# EAGLE design tactile_sensor (EAGLE 9.6.2)
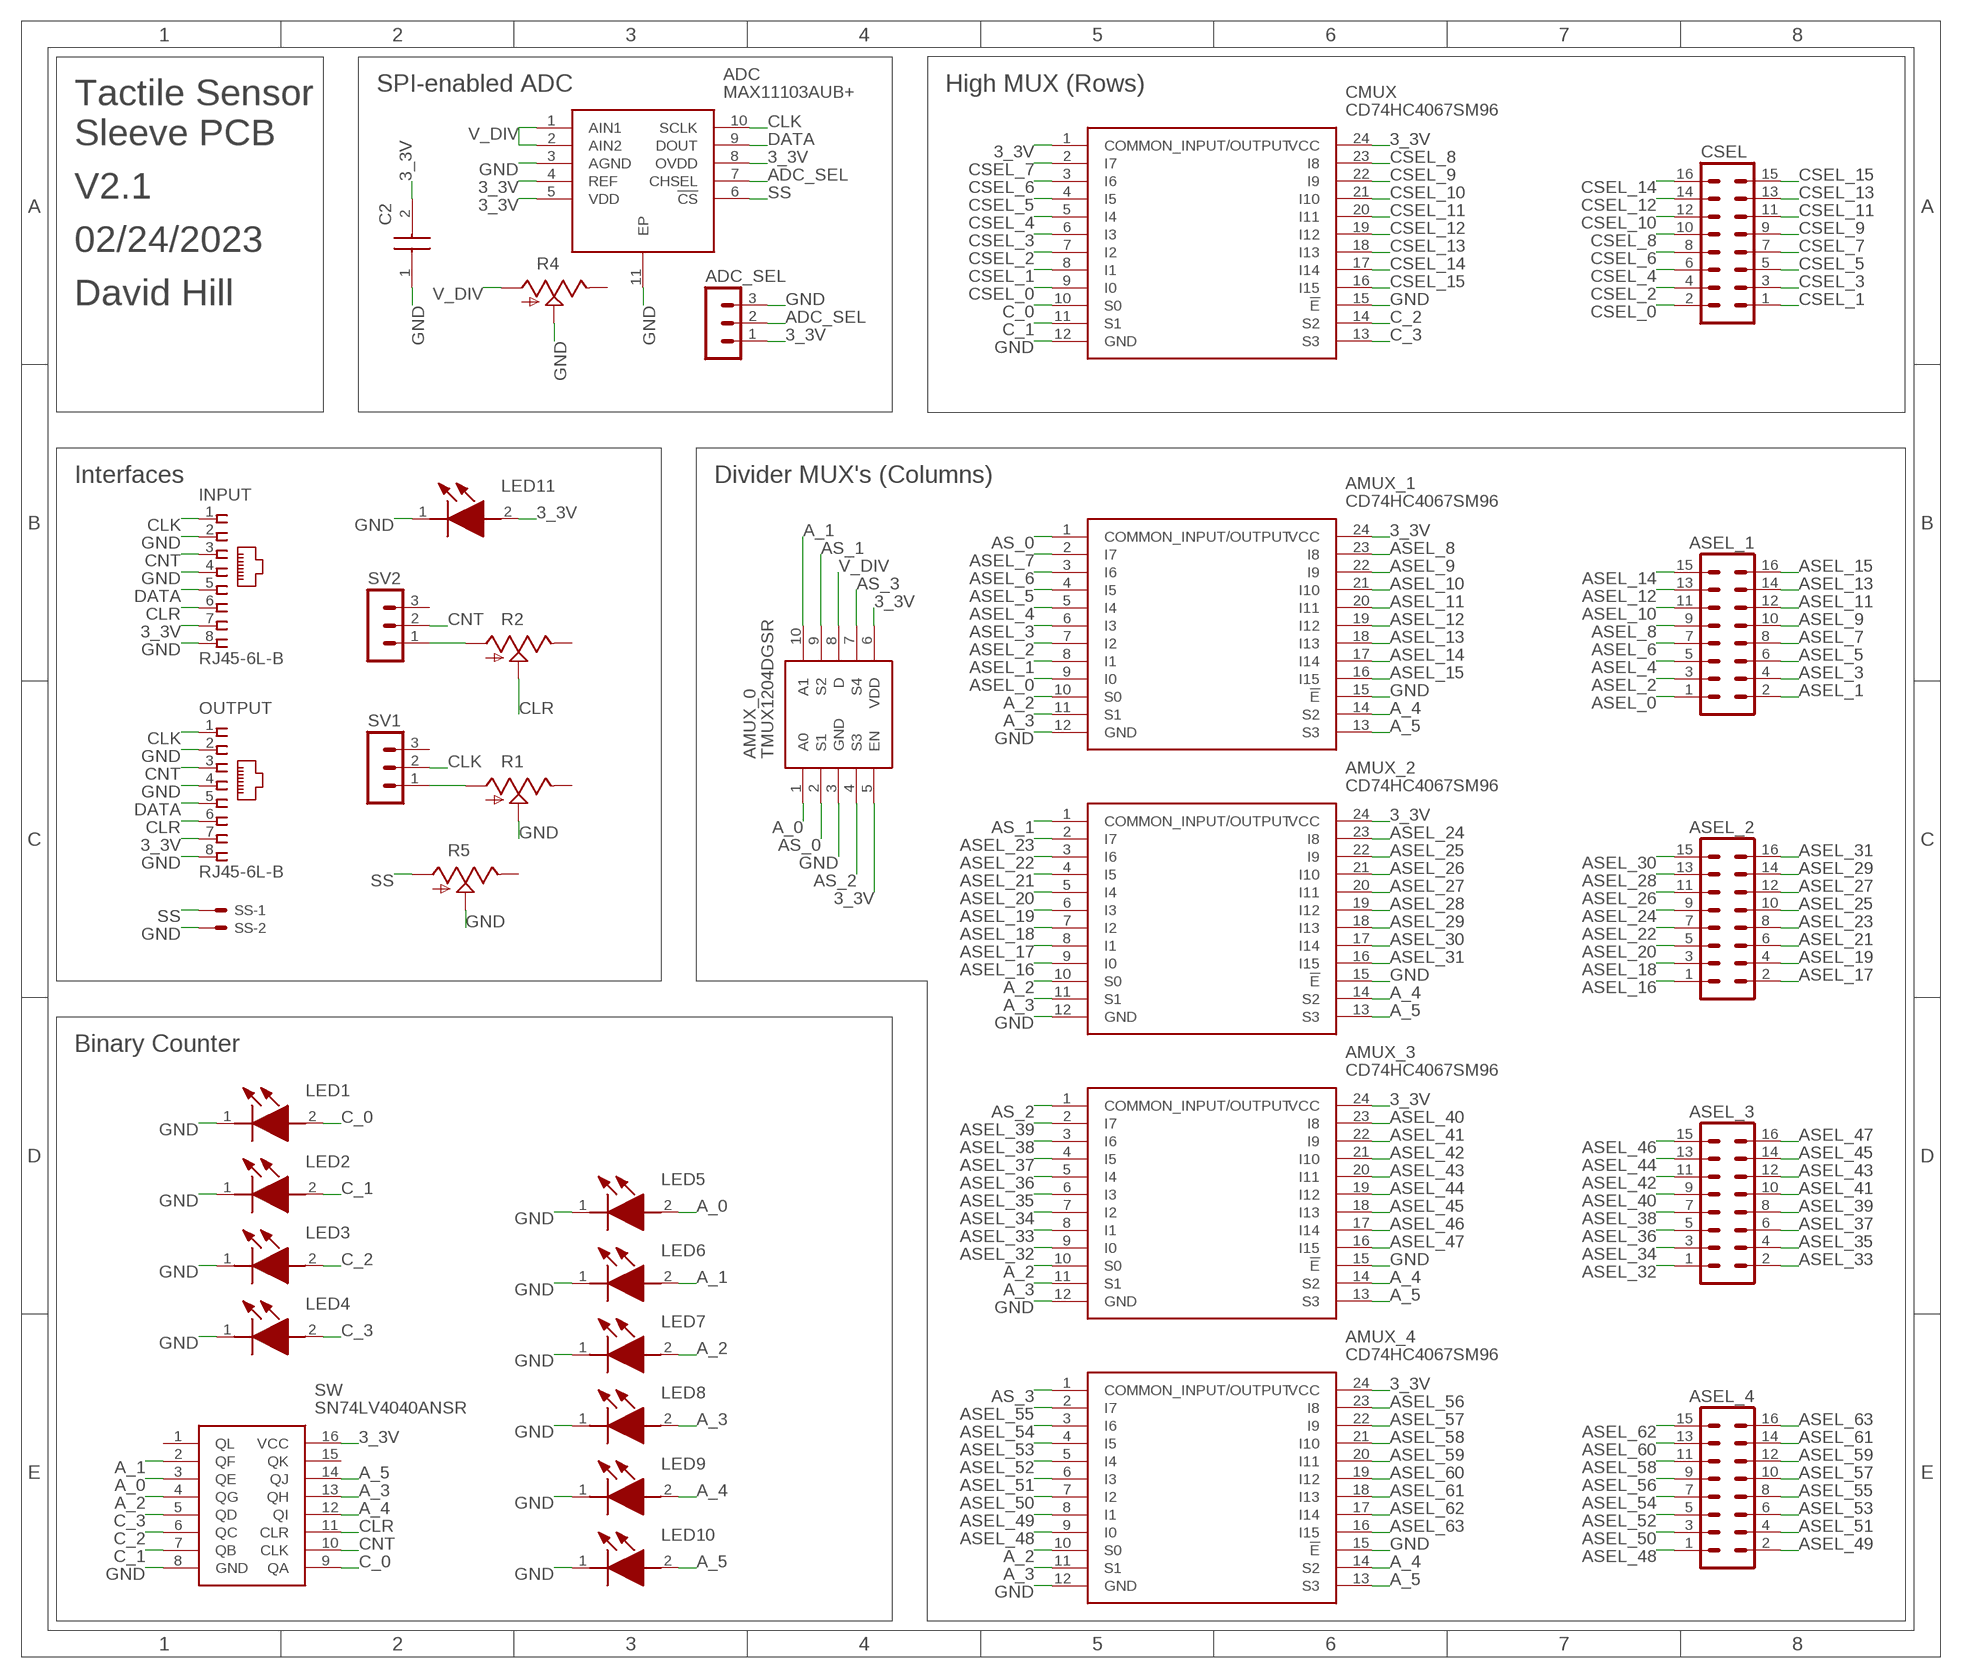
[diagram p0: schematic, sheet 1]

## Parts
ADC  MAX11103AUB+  [SOP50P490X110-11N]
ADC_SEL  MA03-1  [MA03-1]
AMUX_0  TMUX1204DGSR  [SOP50P490X110-10N]
AMUX_1  CD74HC4067SM96  [SOP65P780X200-24N]
AMUX_2  CD74HC4067SM96  [SOP65P780X200-24N]
AMUX_3  CD74HC4067SM96  [SOP65P780X200-24N]
AMUX_4  CD74HC4067SM96  [SOP65P780X200-24N]
ASEL_1  MA08-2  [MA08-2]
ASEL_2  MA08-2  [MA08-2]
ASEL_3  MA08-2  [MA08-2]
ASEL_4  MA08-2  [MA08-2]
C2  C2012X7S1E106K125AE  [C2012_COMMERCIAL]
CMUX  CD74HC4067SM96  [SOP65P780X200-24N]
CSEL  MA08-2  [MA08-2]
INPUT  RJ45-6L-B  [RJ45-NO-SHIELD]
LED1  APHCM2012QBC_D-F01  [APHCM2012QBCDF01]
LED2  APHCM2012QBC_D-F01  [APHCM2012QBCDF01]
LED3  APHCM2012QBC_D-F01  [APHCM2012QBCDF01]
LED4  APHCM2012QBC_D-F01  [APHCM2012QBCDF01]
LED5  APHCM2012QBC_D-F01  [APHCM2012QBCDF01]
LED6  APHCM2012QBC_D-F01  [APHCM2012QBCDF01]
LED7  APHCM2012QBC_D-F01  [APHCM2012QBCDF01]
LED8  APHCM2012QBC_D-F01  [APHCM2012QBCDF01]
LED9  APHCM2012QBC_D-F01  [APHCM2012QBCDF01]
LED10  APHCM2012QBC_D-F01  [APHCM2012QBCDF01]
LED11  APHCM2012QBC_D-F01  [APHCM2012QBCDF01]
OUTPUT  RJ45-6L-B  [RJ45-NO-SHIELD]
R1  TRIM_US-B25P  [B25P]
R2  TRIM_US-B25P  [B25P]
R4  TRIM_US-B25P  [B25P]
R5  TRIM_US-B25P  [B25P]
SS  22-23-2021  [22-23-2021]
SV1  MA03-1  [MA03-1]
SV2  MA03-1  [MA03-1]
SW  SN74LV4040ANSR  [SOIC127P780X200-16N]

## Nets
3_3V: ADC.4(REF) ADC.5(VDD) ADC.8(OVDD) ADC_SEL.1 AMUX_0.5(EN) AMUX_0.6(VDD) AMUX_1.24(VCC) AMUX_2.24(VCC) AMUX_3.24(VCC) AMUX_4.24(VCC) C2.2 CMUX.1(COMMON_INPUT/OUTPUT) CMUX.24(VCC) INPUT.7 LED11.2(A) OUTPUT.7 SW.16(VCC)
A_0: AMUX_0.1(A0) LED5.2(A) SW.3(QE)
A_1: AMUX_0.10(A1) LED6.2(A) SW.2(QF)
A_2: AMUX_1.10(S0) AMUX_2.10(S0) AMUX_3.10(S0) AMUX_4.10(S0) LED7.2(A) SW.4(QG)
A_3: AMUX_1.11(S1) AMUX_2.11(S1) AMUX_3.11(S1) AMUX_4.11(S1) LED8.2(A) SW.13(QH)
A_4: AMUX_1.14(S2) AMUX_2.14(S2) AMUX_3.14(S2) AMUX_4.14(S2) LED9.2(A) SW.12(QI)
A_5: AMUX_1.13(S3) AMUX_2.13(S3) AMUX_3.13(S3) AMUX_4.13(S3) LED10.2(A) SW.14(QJ)
ADC_SEL: ADC.7(CHSEL) ADC_SEL.2
AS_0: AMUX_0.2(S1) AMUX_1.1(COMMON_INPUT/OUTPUT)
AS_1: AMUX_0.9(S2) AMUX_2.1(COMMON_INPUT/OUTPUT)
AS_2: AMUX_0.4(S3) AMUX_3.1(COMMON_INPUT/OUTPUT)
AS_3: AMUX_0.7(S4) AMUX_4.1(COMMON_INPUT/OUTPUT)
ASEL_0: AMUX_1.9(I0) ASEL_1.1
ASEL_1: AMUX_1.8(I1) ASEL_1.2
ASEL_2: AMUX_1.7(I2) ASEL_1.3
ASEL_3: AMUX_1.6(I3) ASEL_1.4
ASEL_4: AMUX_1.5(I4) ASEL_1.5
ASEL_5: AMUX_1.4(I5) ASEL_1.6
ASEL_6: AMUX_1.3(I6) ASEL_1.7
ASEL_7: AMUX_1.2(I7) ASEL_1.8
ASEL_8: AMUX_1.23(I8) ASEL_1.9
ASEL_9: AMUX_1.22(I9) ASEL_1.10
ASEL_10: AMUX_1.21(I10) ASEL_1.11
ASEL_11: AMUX_1.20(I11) ASEL_1.12
ASEL_12: AMUX_1.19(I12) ASEL_1.13
ASEL_13: AMUX_1.18(I13) ASEL_1.14
ASEL_14: AMUX_1.17(I14) ASEL_1.15
ASEL_15: AMUX_1.16(I15) ASEL_1.16
ASEL_16: AMUX_2.9(I0) ASEL_2.1
ASEL_17: AMUX_2.8(I1) ASEL_2.2
ASEL_18: AMUX_2.7(I2) ASEL_2.3
ASEL_19: AMUX_2.6(I3) ASEL_2.4
ASEL_20: AMUX_2.5(I4) ASEL_2.5
ASEL_21: AMUX_2.4(I5) ASEL_2.6
ASEL_22: AMUX_2.3(I6) ASEL_2.7
ASEL_23: AMUX_2.2(I7) ASEL_2.8
ASEL_24: AMUX_2.23(I8) ASEL_2.9
ASEL_25: AMUX_2.22(I9) ASEL_2.10
ASEL_26: AMUX_2.21(I10) ASEL_2.11
ASEL_27: AMUX_2.20(I11) ASEL_2.12
ASEL_28: AMUX_2.19(I12) ASEL_2.13
ASEL_29: AMUX_2.18(I13) ASEL_2.14
ASEL_30: AMUX_2.17(I14) ASEL_2.15
ASEL_31: AMUX_2.16(I15) ASEL_2.16
ASEL_32: AMUX_3.9(I0) ASEL_3.1
ASEL_33: AMUX_3.8(I1) ASEL_3.2
ASEL_34: AMUX_3.7(I2) ASEL_3.3
ASEL_35: AMUX_3.6(I3) ASEL_3.4
ASEL_36: AMUX_3.5(I4) ASEL_3.5
ASEL_37: AMUX_3.4(I5) ASEL_3.6
ASEL_38: AMUX_3.3(I6) ASEL_3.7
ASEL_39: AMUX_3.2(I7) ASEL_3.8
ASEL_40: AMUX_3.23(I8) ASEL_3.9
ASEL_41: AMUX_3.22(I9) ASEL_3.10
ASEL_42: AMUX_3.21(I10) ASEL_3.11
ASEL_43: AMUX_3.20(I11) ASEL_3.12
ASEL_44: AMUX_3.19(I12) ASEL_3.13
ASEL_45: AMUX_3.18(I13) ASEL_3.14
ASEL_46: AMUX_3.17(I14) ASEL_3.15
ASEL_47: AMUX_3.16(I15) ASEL_3.16
ASEL_48: AMUX_4.9(I0) ASEL_4.1
ASEL_49: AMUX_4.8(I1) ASEL_4.2
ASEL_50: AMUX_4.7(I2) ASEL_4.3
ASEL_51: AMUX_4.6(I3) ASEL_4.4
ASEL_52: AMUX_4.5(I4) ASEL_4.5
ASEL_53: AMUX_4.4(I5) ASEL_4.6
ASEL_54: AMUX_4.3(I6) ASEL_4.7
ASEL_55: AMUX_4.2(I7) ASEL_4.8
ASEL_56: AMUX_4.23(I8) ASEL_4.9
ASEL_57: AMUX_4.22(I9) ASEL_4.10
ASEL_58: AMUX_4.21(I10) ASEL_4.11
ASEL_59: AMUX_4.20(I11) ASEL_4.12
ASEL_60: AMUX_4.19(I12) ASEL_4.13
ASEL_61: AMUX_4.18(I13) ASEL_4.14
ASEL_62: AMUX_4.17(I14) ASEL_4.15
ASEL_63: AMUX_4.16(I15) ASEL_4.16
C_0: CMUX.10(S0) LED1.2(A) SW.9(QA)
C_1: CMUX.11(S1) LED2.2(A) SW.7(QB)
C_2: CMUX.14(S2) LED3.2(A) SW.6(QC)
C_3: CMUX.13(S3) LED4.2(A) SW.5(QD)
CLK: ADC.10(SCLK) INPUT.1 OUTPUT.1 SV1.2
CLR: INPUT.6 OUTPUT.6 R2.S SW.11(CLR)
CNT: INPUT.3 OUTPUT.3 SV2.2 SW.10(CLK)
CSEL_0: CMUX.9(I0) CSEL.2
CSEL_1: CMUX.8(I1) CSEL.1
CSEL_2: CMUX.7(I2) CSEL.4
CSEL_3: CMUX.6(I3) CSEL.3
CSEL_4: CMUX.5(I4) CSEL.6
CSEL_5: CMUX.4(I5) CSEL.5
CSEL_6: CMUX.3(I6) CSEL.8
CSEL_7: CMUX.2(I7) CSEL.7
CSEL_8: CMUX.23(I8) CSEL.10
CSEL_9: CMUX.22(I9) CSEL.9
CSEL_10: CMUX.21(I10) CSEL.12
CSEL_11: CMUX.20(I11) CSEL.11
CSEL_12: CMUX.19(I12) CSEL.14
CSEL_13: CMUX.18(I13) CSEL.13
CSEL_14: CMUX.17(I14) CSEL.16
CSEL_15: CMUX.16(I15) CSEL.15
DATA: ADC.9(DOUT) INPUT.5 OUTPUT.5
GND: ADC.3(AGND) ADC.11(EP) ADC_SEL.3 AMUX_0.3(GND) AMUX_1.12(GND) AMUX_1.15(!E) AMUX_2.12(GND) AMUX_2.15(!E) AMUX_3.12(GND) AMUX_3.15(!E) AMUX_4.12(GND) AMUX_4.15(!E) C2.1 CMUX.12(GND) CMUX.15(!E) INPUT.2 INPUT.4 INPUT.8 LED1.1(K) LED2.1(K) LED3.1(K) LED4.1(K) LED5.1(K) LED6.1(K) LED7.1(K) LED8.1(K) LED9.1(K) LED10.1(K) LED11.1(K) OUTPUT.2 OUTPUT.4 OUTPUT.8 R1.S R4.S R5.S SS.2 SW.8(GND)
N$35: R1.A SV1.1
N$41: R2.A SV2.1
SS: ADC.6(!CS) R5.A SS.1
V_DIV: ADC.1(AIN1) ADC.2(AIN2) AMUX_0.8(D) R4.A
Unconnected: R1.E R2.E R4.E R5.E SV1.3 SV2.3 SW.1(QL) SW.15(QK)

## Notes on the sheet
- SPI-enabled ADC | High MUX (Rows)
- Tactile Sensor
  Sleeve PCB
- V2.1
- 02/24/2023
- David Hill
- Interfaces | Divider MUX's (Columns)
- Binary Counter

## Library data of the parts
ADC = SamacSys_Parts:MAX11103AUB+: 3Msps, Low-Power, Serial 12-Bit ADCs Source: Datasheet <https://datasheets.maximintegrated.com/en/ds/MAX11102-MAX11117.pdf>; DESCRIPTION: 3Msps, Low-Power, Serial 12-Bit ADCs; HEIGHT: 1.1mm; MANUFACTURER_NAME: Maxim Integrated; MANUFACTURER_PART_NUMBER: MAX11103AUB+; MOUSER_PART_NUMBER: 700-MAX11103AUB+; MOUSER_PRICE-STOCK: https://www.mouser.co.uk/ProductDetail/Maxim-Integrated/MAX11103AUB%2b?qs=mzcOS1kGbgdW3dlgSnprJw%3D%3D
ADC_SEL SV1 SV2 = con-lstb:MA03-1: PIN HEADER; OC_FARNELL: unknown; OC_NEWARK: unknown
AMUX_0 = SamacSys_Parts:TMUX1204DGSR: 5-V 4:1 general-purpose analog multiplexer Source: Datasheet <http://www.ti.com/lit/gpn/TMUX1204>; ARROW_PART_NUMBER: TMUX1204DGSR; ARROW_PRICE-STOCK: https://www.arrow.com/en/products/tmux1204dgsr/texas-instruments?region=nac; DESCRIPTION: 5-V 4:1 general-purpose analog multiplexer; HEIGHT: 1.1mm; MANUFACTURER_NAME: Texas Instruments; MANUFACTURER_PART_NUMBER: TMUX1204DGSR; MOUSER_PART_NUMBER: 595-TMUX1204DGSR; MOUSER_PRICE-STOCK: https://www.mouser.co.uk/ProductDetail/Texas-Instruments/TMUX1204DGSR?qs=EBDBlbfErPw42Q0DdvAwUg%3D%3D
AMUX_1-AMUX_4 CMUX = SamacSys_Parts:CD74HC4067SM96: High Speed CMOS 16-Ch MUX/DEMUX 24P SOIC CD74HC4067SM96, Multiplexer/Demultiplexer Single 16:1, 3 V, 5 V, 24-Pin, SSOP, 1 Source: Datasheet <https://datasheet.datasheetarchive.com/originals/distributors/SFDatasheet-6/sf-000127204.pdf>; ARROW_PART_NUMBER: CD74HC4067SM96; ARROW_PRICE-STOCK: https://www.arrow.com/en/products/cd74hc4067sm96/texas-instruments?region=nac; DESCRIPTION: High Speed CMOS 16-Ch MUX/DEMUX 24P SOIC CD74HC4067SM96, Multiplexer/Demultiplexer Single 16:1, 3 V, 5 V, 24-Pin, SSOP, 1; HEIGHT: 2mm; MANUFACTURER_NAME: Texas Instruments; MANUFACTURER_PART_NUMBER: CD74HC4067SM96; MOUSER_PART_NUMBER: 595-CD74HC4067SM96; MOUSER_PRICE-STOCK: https://www.mouser.co.uk/ProductDetail/Texas-Instruments/CD74HC4067SM96?qs=JHHQeKcAU3DyfvAOSRLjhQ%3D%3D
ASEL_1-ASEL_4 CSEL = con-lstb:MA08-2: PIN HEADER; OC_FARNELL: unknown; OC_NEWARK: unknown
C2 = SamacSys_Parts:C2012X7S1E106K125AE: MULTILAYER CERAMIC CHIP CAPACITORS, 2012, Commercial grade, general (Up to 75V) Source: Datasheet <https://product.tdk.com/system/files/dam/doc/product/capacitor/ceramic/mlcc/catalog/mlcc_commercial_soft_en.pdf>; DESCRIPTION: MULTILAYER CERAMIC CHIP CAPACITORS, 2012, Commercial grade, general (Up to 75V); HEIGHT: 0.75mm; MANUFACTURER_NAME: TDK; MANUFACTURER_PART_NUMBER: C2012X7S1E106K125AE; MOUSER_PART_NUMBER: 810-C2012X7S1E106125; MOUSER_PRICE-STOCK: https://www.mouser.co.uk/ProductDetail/TDK/C2012X7S1E106K125AE?qs=P1JMDcb91o5L0SBQ9NWlYQ%3D%3D
INPUT OUTPUT = con-tycoelectronics:RJ45: CORCOM Modular RJ Jacks No Shield Source: www.tycoelectronics.com .. ENG_DS_1654001_1099_RJ_L_0507.pdf; MPN: RJ45-6L-B; OC_FARNELL: unknown; OC_NEWARK: 16R6090
LED1-LED11 = SamacSys_Parts:APHCM2012QBC_D-F01: Standard LEDs - SMD Blue 465nm 100mcd, 20mA Source: Datasheet <http://www.kingbrightusa.com/images/catalog/SPEC/APHCM2012QBC-D-F01.pdf>; DESCRIPTION: Standard LEDs - SMD Blue 465nm 100mcd, 20mA; HEIGHT: 0.5mm; MANUFACTURER_NAME: Kingbright; MANUFACTURER_PART_NUMBER: APHCM2012QBC/D-F01; MOUSER_PART_NUMBER: 604-APHCM2012QBC/D; MOUSER_PRICE-STOCK: https://www.mouser.co.uk/ProductDetail/Kingbright/APHCM2012QBC-D-F01?qs=f499HRGa1RlxiBcBPagxyQ%3D%3D
R1 R2 R4 R5 = pot:TRIM_US-: POTENTIOMETER
SS = con-molex:22-23-2021: .100" (2.54mm) Center Header - 2 Pin; MF: MOLEX; MPN: 22-23-2021; OC_FARNELL: 1462926; OC_NEWARK: 25C3832
SW = SamacSys_Parts:SN74LV4040ANSR: 12-Bit Asynchronous Binary Counter Source: Datasheet <http://www.ti.com/lit/gpn/sn74lv4040a>; ARROW_PART_NUMBER: SN74LV4040ANSR; ARROW_PRICE-STOCK: https://www.arrow.com/en/products/sn74lv4040ansr/texas-instruments; DESCRIPTION: 12-Bit Asynchronous Binary Counter; HEIGHT: 2mm; MANUFACTURER_NAME: Texas Instruments; MANUFACTURER_PART_NUMBER: SN74LV4040ANSR; MOUSER_PART_NUMBER: 595-SN74LV4040ANSR; MOUSER_PRICE-STOCK: https://www.mouser.co.uk/ProductDetail/Texas-Instruments/SN74LV4040ANSR?qs=UG%2F8xqv%2F6WcRFg7ueexu4A%3D%3D

## Board
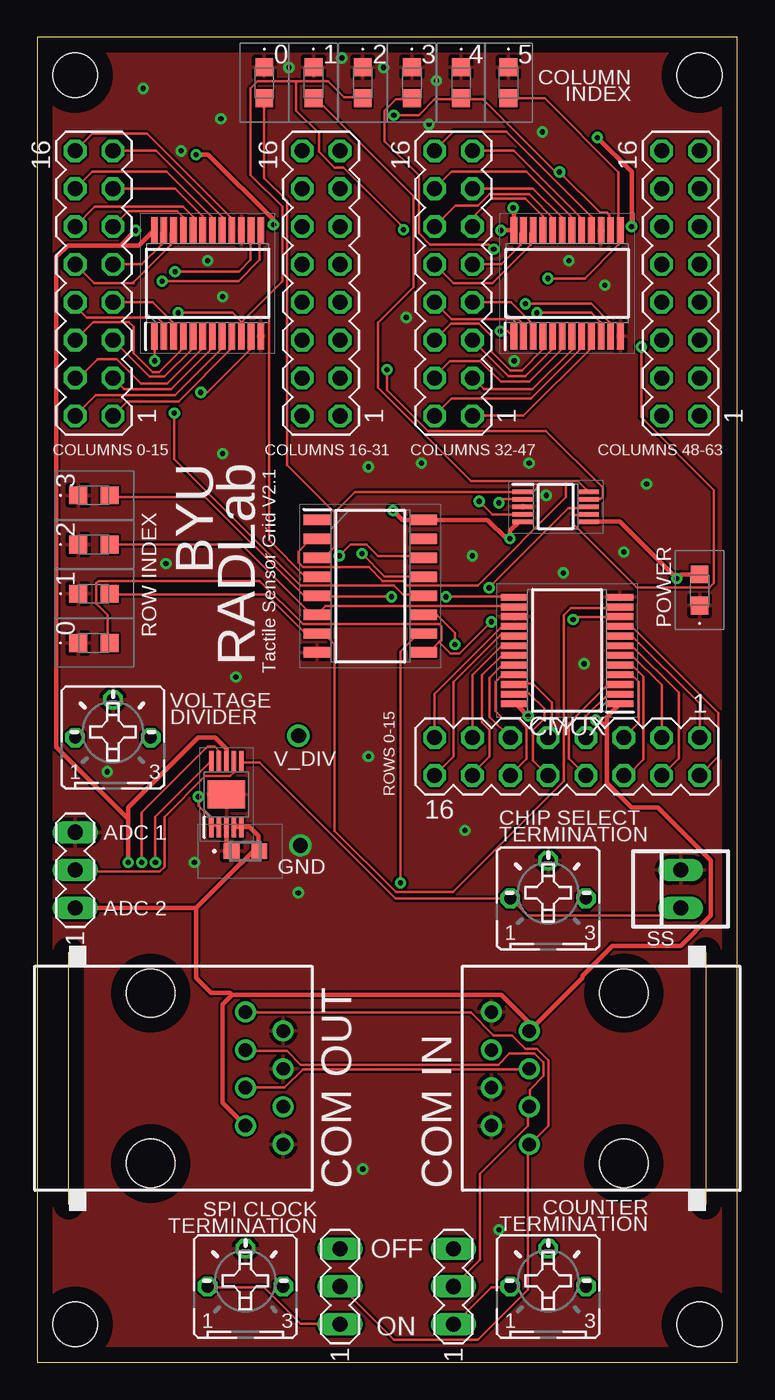
[diagram p1: board, top side]
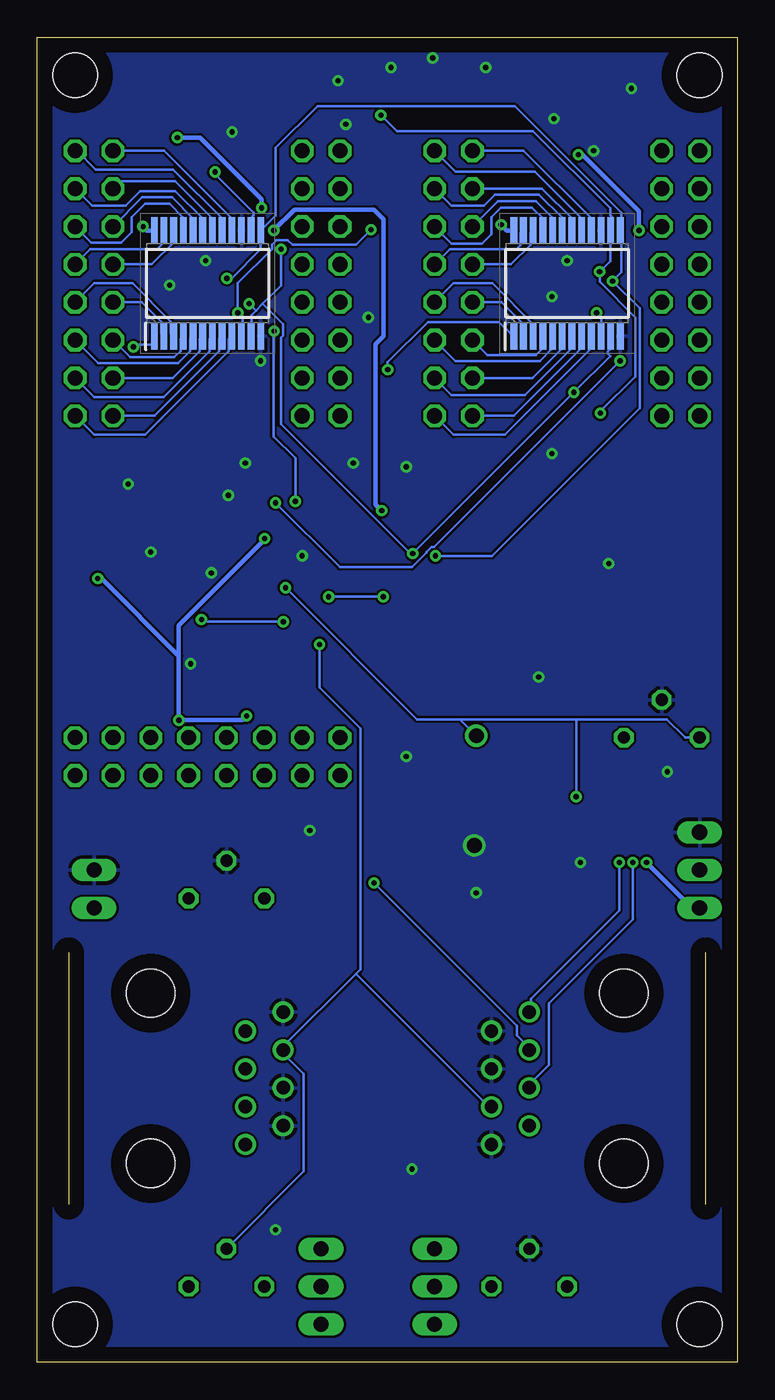
[diagram p2: board, bottom side, seen from below]

Size 46.99 x 88.9 mm. Coordinates in mm from the lower left corner, seen from the top.
Outline: 0,0 46.99,0 46.99,88.9 0,88.9 0,0
Copper layers (1*16): Top 0.035mm / dielectric 1.5mm / Bottom 0.035mm
Design rules "default": minimum track width 6mil, minimum drill 0.35mm, track to track 6mil, track to pad 6mil, pad to pad 6mil, via to via 6mil, smd to smd 6mil, copper to edge 40mil, drill to drill 6mil, minimum pad ring 10mil, minimum via ring 8mil, stop-mask expansion 4mil, vias tented up to drill 0mil, thermal gap 10mil
Holes 3 mm at 2.54,86.36 44.45,86.36 2.54,2.54 44.45,2.54

### Footprints (pad centres in the part's own frame; a part is rotated, then mirrored left to right if it is on the bottom)
SOP50P490X110-11N = smd 1.4 x 0.3: 1 -2.2,1; 2 -2.2,0.5; 3 -2.2,0; 4 -2.2,-0.5; 5 -2.2,-1; 6 2.2,-1; 7 2.2,-0.5; 8 2.2,0; 9 2.2,0.5; 10 2.2,1 | smd 1.88 x 2.515: 11 0,0
MA03-1 = drill 1.016 long: 1 -2.54,0; 2 0,0; 3 2.54,0
SOP50P490X110-10N = smd 1.4 x 0.3: 1 -2.2,1; 2 -2.2,0.5; 3 -2.2,0; 4 -2.2,-0.5; 5 -2.2,-1; 6 2.2,-1; 7 2.2,-0.5; 8 2.2,0; 9 2.2,0.5; 10 2.2,1
SOP65P780X200-24N = smd 1.8 x 0.45: 1 -3.55,3.575; 2 -3.55,2.925; 3 -3.55,2.275; 4 -3.55,1.625; 5 -3.55,0.975; 6 -3.55,0.325; 7 -3.55,-0.325; 8 -3.55,-0.975; 9 -3.55,-1.625; 10 -3.55,-2.275; 11 -3.55,-2.925; 12 -3.55,-3.575; 13 3.55,-3.575; 14 3.55,-2.925; 15 3.55,-2.275; 16 3.55,-1.625; 17 3.55,-0.975; 18 3.55,-0.325; 19 3.55,0.325; 20 3.55,0.975; 21 3.55,1.625; 22 3.55,2.275; 23 3.55,2.925; 24 3.55,3.575
MA08-2 = drill 1.016 octagon: 1 -8.89,-1.27; 2 -8.89,1.27; 3 -6.35,-1.27; 4 -6.35,1.27; 5 -3.81,-1.27; 6 -3.81,1.27; 7 -1.27,-1.27; 8 -1.27,1.27; 9 1.27,-1.27; 10 1.27,1.27; 11 3.81,-1.27; 12 3.81,1.27; 13 6.35,-1.27; 14 6.35,1.27; 15 8.89,-1.27; 16 8.89,1.27
C2012_COMMERCIAL = smd 1.05 x 1.05: 1 -0.925,0; 2 0.925,0
RJ45-NO-SHIELD = drill 0.9 pad 1.4: 1 -4.445,6.35; 2 -3.175,8.89; 3 -1.905,6.35; 4 -0.635,8.89; 5 0.635,6.35; 6 1.905,8.89; 7 3.175,6.35; 8 4.445,8.89 | hole 3.251: -5.715,0; 5.715,0
APHCM2012QBCDF01 = smd 1.2 x 1.2: 1 -1.05,0; 2 1.05,0
B25P = drill 0.813 octagon: A -2.54,0; E 2.54,0; S 0,2.54
22-23-2021 = drill 1 long: 1 -1.27,0; 2 1.27,0
SOIC127P780X200-16N = smd 1.825 x 0.7: 1 -3.562,4.445; 2 -3.562,3.175; 3 -3.562,1.905; 4 -3.562,0.635; 5 -3.562,-0.635; 6 -3.562,-1.905; 7 -3.562,-3.175; 8 -3.562,-4.445; 9 3.562,-4.445; 10 3.562,-3.175; 11 3.562,-1.905; 12 3.562,-0.635; 13 3.562,0.635; 14 3.562,1.905; 15 3.562,3.175; 16 3.562,4.445

### Placement (x,y rotation side)
ADC  12.7,38.1 90 top
ADC_SEL  2.54,33.02 90 top
AMUX_0  34.8,57.4 0 top
AMUX_1  11.43,72.39 90 top
AMUX_2  11.43,72.39 90 bottom
AMUX_3  35.56,72.39 90 top
AMUX_4  35.56,72.39 90 bottom
ASEL_1  3.81,72.39 90 top
ASEL_2  19.05,72.39 90 top
ASEL_3  27.94,72.39 90 top
ASEL_4  43.18,72.39 90 top
C2  13.97,34.29 0 top
CMUX  35.56,47.75 180 top
CSEL  35.56,40.64 180 top
INPUT  39.37,19.05 90 top
LED1  3.81,48.26 0 top
LED2  3.81,51.56 0 top
LED3  3.81,54.86 0 top
LED4  3.81,58.17 0 top
LED5  15.24,85.85 270 top
LED6  18.54,85.85 270 top
LED7  21.84,85.85 270 top
LED8  25.15,85.85 270 top
LED9  28.45,85.85 270 top
LED10  31.62,85.85 270 top
LED11  44.45,51.82 90 top
OUTPUT  7.62,19.05 270 top
R1  13.97,5.08 0 top
R2  34.29,5.08 0 top
R4  5.08,41.91 0 top
R5  34.29,31.11 0 top
SS  43.18,31.75 90 top
SV1  20.32,5.08 90 top
SV2  27.94,5.08 90 top
SW  22.35,52.07 0 top

### Tracks (layer width: path | path; a pad name or v marks a point on that pad's centre or on a via)
3_3V  (via drill 0.35)
  Top 0.152: 7.77,75.89 AMUX_1.24
  Top 0.305: 13.08,24.64 12.45,24 12.45,17.4 OUTPUT.7 | 13.08,24.64 31.14,24.64 33.02,22.76 INPUT.7 36.58,25.78 36.58,25.92 38.59,27.94 43.18,27.94 45.21,29.97 45.21,33.66 41.66,37.21 39.88,37.21 38.23,38.86 38.23,42.55 | 13.08,24.64 12.95,24.77 11.68,24.77 10.67,25.78 10.67,30.48 | 10.67,30.48 13.65,33.46 13.7,33.46 14.53,34.29 C2.2 14.86,34.33 14.86,35.31 14.27,35.9 ADC.5 ADC.4 | 10.67,30.48 ADC_SEL.1 | CMUX.1 38.23,43.29 38.23,42.55 | 38.23,42.55 37.69,43.08 v37.49,43.08 | v32.94,43.36 32.12,44.18 CMUX.24 | LED11.2 43.21,52.87 v42.93,52.58 39.1,56.4 AMUX_0.6 | AMUX_0.5 32.34,56.4 31.73,55.79 v31.73,55.27 31.47,55.27 30.23,56.52 SW.16 24.51,56.52 v23.88,57.15 | v6.1,33.53 6.1,36.45 | 7.77,75.89 6.81,74.93 5.59,74.93 | 6.1,36.45 1.27,41.27 1.27,74.17 2.03,74.93 5.59,74.93 | 5.59,74.93 v6.6,75.95 | v15.85,76.33 15.85,76.65 11.47,81.03 v10.67,81.03 | v39.89,76.2 39.89,79.87 v37.59,82.17 | v31.94,77.45 31.98,77.4 AMUX_3.24 31.98,75.95 v31.11,75.95 | 6.1,36.45 6.1,37.21 10.79,41.91 11.94,41.91 12.7,41.15 ADC.8
  Bottom 0.305: v6.1,33.53 3.05,30.48 ADC_SEL.1 | v32.94,43.36 33.22,43.08 v37.49,43.08 37.49,47.4 | v42.93,52.58 42.67,52.58 37.49,47.4 | v31.73,55.27 31.73,55.19 37.49,49.43 37.49,47.4 | v6.6,75.95 6.6,77.22 10.41,81.03 v10.67,81.03 | AMUX_2.24 15.46,75.94 v15.85,76.33 | AMUX_4.24 39.63,75.94 v39.89,76.2 | v37.59,82.17 36.07,82.17 31.94,78.04 v31.94,77.45 | v31.11,75.95 29.72,77.34 24.38,77.34 23.75,76.71 23.75,68.83 24.28,68.3 24.28,57.55 v23.88,57.15
A_0
  Top 0.152: LED5.2 15.24,79.45 16.76,77.93 16.76,60.2 19.96,57 | 19.96,57 19.96,54.71 19.36,54.1 18.9,54.1 SW.3 | AMUX_0.1 32.46,58.37 21.34,58.37 19.96,57
A_1
  Top 0.152: 35.48,59.13 36.27,59.13 36.88,58.52 AMUX_0.10 | 35.48,59.13 29.11,59.13 22.86,65.38 22.86,69.75 25.25,72.14 25.25,78.23 19.2,84.28 19.05,84.28 18.59,84.73 LED6.2 | 35.48,59.13 35.48,58.04 29.57,52.12 24.84,52.12 24.54,52.43 23.16,52.43 22.25,53.34 17.83,53.34 17.53,53.65 17.53,54.41 18.29,55.17 18.75,55.17 SW.2
A_2  (via drill 0.35)
  Top 0.152: v33.53,70.41 37.19,70.41 37.8,69.8 37.8,68.89 AMUX_3.10 | 17.37,85.95 14.78,85.95 14.33,85.5 14.33,79.65 16.46,77.52 16.46,72.54 15.52,71.6 | 17.37,85.95 19.51,85.95 20.57,84.89 21.79,84.89 LED7.2 | 13.72,69.8 15.52,71.6 | 13.72,69.8 13.72,68.89 AMUX_1.10 | v9.45,70.41 13.11,70.41 13.72,69.8 | 15.52,71.6 15.54,71.58 15.54,55.17 17.98,52.73 18.75,52.73 SW.4 | v24.59,76 24.59,76.12 20.55,80.16 19.96,80.16 18.9,81.23 18.9,82.45 17.37,83.97 17.37,85.95
  Bottom 0.152: AMUX_4.10 33.22,68.89 33.22,70.1 v33.53,70.41 33.53,72.39 31.24,74.68 31.24,74.98 30.94,75.29 30.18,75.29 29.87,74.98 25.6,74.98 v24.59,76 | v9.45,70.41 9.14,70.1 9.14,68.89 AMUX_2.10
A_3  (via drill 0.35)
  Top 0.152: v30.63,74.68 30.33,74.98 26.36,74.98 25.6,75.74 25.6,79.65 23.32,81.94 23.32,83.97 24.08,84.73 25.15,84.73 LED8.2 | v32.77,71.02 37.19,71.02 38.41,69.8 38.41,68.89 AMUX_3.11 | v10.97,65.08 11.43,65.08 14.33,67.97 14.33,68.73 AMUX_1.11 | v21.79,54.25 23.32,52.73 25.91,52.73 SW.13
  Bottom 0.152: v30.63,74.68 30.63,72.24 31.85,71.02 | 32.31,70.56 32.61,70.26 32.61,68.89 AMUX_4.11 | 32.31,70.56 31.85,71.02 | 32.31,70.56 v32.77,71.02 | AMUX_2.11 8.53,68.73 8.53,67.97 8.69,67.82 8.69,67.67 8.53,67.51 v10.97,65.08 v21.79,54.25 21.95,54.25 30.63,62.94 30.63,68.73 30.48,68.89 30.48,69.65 31.85,71.02
A_4  (via drill 0.35)
  Top 0.152: AMUX_3.14 38.41,76.05 38.41,76.96 38.25,77.11 37.8,77.11 v35.05,79.86 34.8,79.86 29.92,84.73 28.5,84.73 LED9.2 28.35,84.73 26.67,84.73 25.6,83.67 v23.93,83.67 | v9.25,73.18 13.54,73.18 14.33,73.97 14.33,75.89 AMUX_1.14 | v9.2,63.68 9.2,60.6 17.68,52.12 23.93,52.12 24.54,51.51 25.91,51.51 SW.12
  Bottom 0.152: v35.05,79.86 35.05,79.7 32.46,77.11 32.46,76.96 32.61,76.81 32.61,76.05 AMUX_4.14 | v9.2,63.68 9.2,63.8 6.86,66.14 6.86,70.1 9.25,72.49 v9.25,73.18 8.53,73.89 8.53,75.89 AMUX_2.14 8.38,76.05 8.38,76.81 8.53,76.96 8.53,77.42 13.72,82.6 22.86,82.6 v23.93,83.67
A_5  (via drill 0.35)
  Top 0.152: v34.27,72.72 36.75,72.72 39.01,74.98 39.01,75.89 AMUX_3.13 39.01,76.05 39.01,79.86 34.07,84.8 LED10.2 | v8.38,72.54 13.51,72.54 14.94,73.97 14.94,75.89 AMUX_1.13 | v20.27,54.1 21.03,54.86 22.1,54.86 22.86,54.1 25.91,54.1 SW.14
  Bottom 0.152: v34.27,72.72 33.96,72.72 32,74.68 32,75.89 AMUX_4.13 30.99,76.94 30.99,81.48 28.19,84.28 14.94,84.28 7.77,77.11 7.77,76.05 AMUX_2.13 7.77,75.89 7.77,73.15 v8.38,72.54 6.55,70.71 6.55,64.01 16.46,54.1 v20.27,54.1
ADC_SEL
  Top 0.152: ADC.7 13.23,40.27 13.23,39.6 12.95,39.32 11.28,39.32 8.53,36.58 8.53,33.22 8.23,32.92 2.59,32.92 ADC_SEL.2
AS_0  (via drill 0.35)
  Top 0.152: AMUX_1.1 7.87,68.82 v7.87,67.18 | v30.99,57.66 31.23,57.9 AMUX_0.2
  Bottom 0.152: v7.87,67.18 20.35,54.71 20.52,54.71 20.88,54.35 20.88,54.31 21.85,53.34 26.67,53.34 v30.99,57.66
AS_1  (via drill 0.35)
  Top 0.152: v23.47,66.6 23.47,65.23 26.21,62.48 34.14,62.48 37.95,58.67 37.95,58.06 37.8,57.91 37.03,57.91 AMUX_0.9
  Bottom 0.152: v23.47,66.6 23.47,67.11 20.78,69.8 16,69.8 15.24,69.04 15.09,69.04 14.94,68.89 AMUX_2.1
AS_2  (via drill 0.35)
  Top 0.152: AMUX_0.4 32.56,56.87 30.56,56.87 v29.67,57.76 | v31.09,69.19 31.55,69.19 31.85,68.89 AMUX_3.1
  Bottom 0.152: v29.67,57.76 29.67,60.66 31.11,62.1 31.11,69.16 v31.09,69.19
AS_3  (via drill 0.35)
  Top 0.152: v40.54,68.12 40.54,63.4 45.41,58.52 45.41,52.27 45.11,51.97 40.23,51.97 35.97,56.24 35.97,56.69 36.12,56.84 36.88,56.84 AMUX_0.7
  Bottom 0.152: v40.54,68.12 40.39,68.28 39.32,68.28 39.17,68.43 39.17,68.73 AMUX_4.1
ASEL_0
  Top 0.152: ASEL_1.1 6.04,64.47 9.48,64.47 12.99,67.97 12.99,68.77 AMUX_1.9
ASEL_1
  Top 0.152: AMUX_1.8 12.34,68.77 12.34,67.97 9.26,64.9 3.94,64.9 ASEL_1.2
ASEL_2
  Top 0.152: AMUX_1.7 11.69,68.77 11.69,67.97 8.99,65.28 5.84,65.28 ASEL_1.3
ASEL_3
  Top 0.152: AMUX_1.6 11.04,68.77 11.04,67.97 8.72,65.66 6.99,65.66 5.33,67.31 4.06,67.31 2.79,66.04 ASEL_1.4
ASEL_4
  Top 0.152: ASEL_1.5 7.54,66.12 8.53,66.12 10.39,67.97 10.39,68.77 AMUX_1.5
ASEL_5
  Top 0.152: AMUX_1.4 9.74,68.77 9.74,67.97 8.18,66.42 7.75,66.42 6.48,67.69 6.48,69.47 6.15,69.8 3.76,69.8 ASEL_1.6
ASEL_6
  Top 0.152: ASEL_1.7 7.75,71.12 9.15,69.71 AMUX_1.3
ASEL_7
  Top 0.152: AMUX_1.2 8.44,68.91 8.44,69.71 8.04,70.1 3.3,70.1 2.54,70.87 ASEL_1.8
ASEL_8
  Top 0.152: AMUX_1.23 8.31,75.74 8.31,74.94 7.02,73.66 ASEL_1.9
ASEL_9
  Top 0.152: AMUX_1.22 8.96,75.74 8.96,74.94 6.48,72.46 6.48,72.39 3.81,72.39 ASEL_1.10
ASEL_10
  Top 0.152: AMUX_1.21 9.78,75.97 9.78,76.83 9.4,77.22 6.1,77.22 ASEL_1.11
ASEL_11
  Top 0.152: AMUX_1.20 10.51,76 10.51,76.79 9.78,77.52 3.86,77.52 ASEL_1.12
ASEL_12
  Top 0.152: AMUX_1.19 11.11,76.91 9.27,78.74 ASEL_1.13
ASEL_13
  Top 0.152: AMUX_1.18 11.81,76 11.81,76.76 8.69,79.88 3.68,79.88 ASEL_1.14
ASEL_14
  Top 0.152: AMUX_1.17 12.46,76 12.46,76.79 7.97,81.28 ASEL_1.15
ASEL_15
  Top 0.152: AMUX_1.16 13.11,76 13.11,76.68 7.37,82.42 3.68,82.42 ASEL_1.16
ASEL_16
  Bottom 0.152: AMUX_2.9 9.75,68.78 9.75,68.1 15.62,62.23 19.05,62.23 ASEL_2.1
ASEL_17
  Bottom 0.152: AMUX_2.8 10.4,68.78 10.4,68.1 15,63.5 ASEL_2.2
ASEL_18
  Bottom 0.152: AMUX_2.7 11.05,68.78 11.05,68.1 14.25,64.9 19.18,64.9 ASEL_2.3
ASEL_19
  Bottom 0.152: AMUX_2.6 11.82,68.77 11.82,67.97 13.76,66.04 ASEL_2.4
ASEL_20
  Bottom 0.152: AMUX_2.5 12.47,68.77 12.47,67.97 13.26,67.18 18.92,67.18 ASEL_2.5
ASEL_21
  Bottom 0.152: AMUX_2.4 13,68.78 13,68.1 13.53,67.56 16.76,67.56 ASEL_2.6
ASEL_22
  Bottom 0.152: AMUX_2.3 13.65,68.9 13.65,69.58 16.46,72.39 19.05,72.39 ASEL_2.7
ASEL_23
  Bottom 0.152: AMUX_2.2 14.3,68.9 14.3,69.58 15.84,71.12 ASEL_2.8
ASEL_24
  Bottom 0.152: AMUX_2.23 14.55,75.74 14.55,74.94 14.82,74.68 19.3,74.68 ASEL_2.9
ASEL_25
  Bottom 0.152: AMUX_2.22 13.9,75.74 13.9,74.94 15.19,73.66 ASEL_2.10
ASEL_26
  Bottom 0.152: AMUX_2.21 13,76 13,76.68 13.79,77.47 15.88,77.47 16.51,76.83 16.51,75.69 17.14,75.06 19.18,75.06 ASEL_2.11
ASEL_27
  Bottom 0.152: AMUX_2.20 12.4,76.79 13.51,77.9 16.08,77.9 ASEL_2.12
ASEL_28
  Bottom 0.152: AMUX_2.19 11.76,76.78 13.31,78.33 16.28,78.33 17.02,77.6 19.18,77.6 ASEL_2.13
ASEL_29
  Bottom 0.152: AMUX_2.18 11.05,76 11.05,76.68 13.11,78.74 ASEL_2.14
ASEL_30
  Bottom 0.152: AMUX_2.17 10.46,76.75 13.59,79.88 18.92,79.88 ASEL_2.15
ASEL_31
  Bottom 0.152: AMUX_2.16 9.75,76 9.75,76.68 14.35,81.28 ASEL_2.16
ASEL_32
  Top 0.152: AMUX_3.9 37.24,68.78 37.24,68.1 32.64,63.5 ASEL_3.1
ASEL_33
  Top 0.152: AMUX_3.8 36.59,68.78 36.59,68.1 33.14,64.64 27.81,64.64 ASEL_3.2
ASEL_34
  Top 0.152: AMUX_3.7 35.94,68.78 35.94,67.97 33.25,65.28 29.97,65.28 ASEL_3.3
ASEL_35
  Top 0.152: AMUX_3.6 35.23,68 33.02,65.79 31.11,65.79 29.72,67.18 27.69,67.18 26.67,66.17 ASEL_3.4
ASEL_36
  Top 0.152: AMUX_3.5 34.59,67.99 32.77,66.17 31.62,66.17 ASEL_3.5
ASEL_37
  Top 0.152: AMUX_3.4 33.94,67.97 32.51,66.55 31.75,66.55 30.48,67.82 30.48,68.83 29.64,69.67 27.76,69.67 ASEL_3.6
ASEL_38
  Top 0.152: AMUX_3.3 33.34,68.9 33.34,69.58 31.8,71.12 ASEL_3.7
ASEL_39
  Top 0.152: AMUX_3.2 32.69,68.9 32.69,69.58 32.3,69.98 27.81,69.98 ASEL_3.8
ASEL_40
  Top 0.152: AMUX_3.23 32.44,75.74 32.44,74.94 31.15,73.66 ASEL_3.9
ASEL_41
  Top 0.152: AMUX_3.22 33.09,75.74 33.09,74.94 30.53,72.39 27.94,72.39 ASEL_3.10
ASEL_42
  Top 0.152: ASEL_3.11 29.21,76.78 30.48,78.05 32.77,78.05 33.94,76.89 AMUX_3.21
ASEL_43
  Top 0.152: AMUX_3.20 34.71,76.07 34.71,76.67 33.02,78.36 30.35,78.36 29.59,77.6 28.07,77.6 ASEL_3.12
ASEL_44
  Top 0.152: AMUX_3.19 35.23,76.78 33.27,78.74 ASEL_3.13
ASEL_45
  Top 0.152: AMUX_3.18 35.94,76 35.94,76.76 32.82,79.88 27.81,79.88 ASEL_3.14
ASEL_46
  Top 0.152: AMUX_3.17 36.59,76 36.59,76.68 31.99,81.28 ASEL_3.15
ASEL_47
  Top 0.152: AMUX_3.16 37.19,76.86 31.5,82.55 27.94,82.55 ASEL_3.16
ASEL_48
  Bottom 0.152: AMUX_4.9 34.13,68.64 34.13,67.84 39.75,62.23 43.18,62.23 ASEL_4.1
ASEL_49
  Bottom 0.152: AMUX_4.8 34.78,68.64 34.78,67.84 39.13,63.5 ASEL_4.2
ASEL_50
  Bottom 0.152: AMUX_4.7 35.43,68.64 35.43,67.84 38.51,64.77 43.18,64.77 ASEL_4.3
ASEL_51
  Bottom 0.152: AMUX_4.6 36.08,68.64 36.08,67.84 37.89,66.04 ASEL_4.4
ASEL_52
  Bottom 0.152: AMUX_4.5 36.73,68.64 36.73,67.84 37.55,67.03 42.9,67.03 ASEL_4.5
ASEL_53
  Bottom 0.152: AMUX_4.4 37.38,68.64 37.38,67.84 37.79,67.44 40.77,67.44 ASEL_4.6
ASEL_54
  Bottom 0.152: AMUX_4.3 38.03,69.04 38.03,69.83 40.59,72.39 43.18,72.39 ASEL_4.7
ASEL_55
  Bottom 0.152: AMUX_4.2 38.68,69.04 38.68,69.83 39.97,71.12 ASEL_4.8
ASEL_56
  Bottom 0.152: AMUX_4.23 38.43,75.88 38.43,75.2 38.95,74.68 43.43,74.68 ASEL_4.9
ASEL_57
  Bottom 0.152: AMUX_4.22 37.78,75.88 37.78,75.2 39.32,73.66 ASEL_4.10
ASEL_58
  Bottom 0.152: AMUX_4.21 37.19,76.81 38.1,77.72 39.75,77.72 40.64,76.83 40.64,75.81 41.35,75.11 43.36,75.11 ASEL_4.11
ASEL_59
  Bottom 0.152: ASEL_4.12 39.95,78.16 37.95,78.16 36.53,76.74 AMUX_4.20
ASEL_60
  Bottom 0.152: AMUX_4.19 35.83,76 35.83,76.68 37.73,78.59 40.08,78.59 41.07,77.6 43.31,77.6 ASEL_4.13
ASEL_61
  Bottom 0.152: AMUX_4.18 35.18,76 35.18,76.68 37.74,79.25 41.4,79.25 ASEL_4.14
ASEL_62
  Bottom 0.152: AMUX_4.17 34.53,76 34.53,76.68 37.86,80.01 43.05,80.01 44.32,81.28 ASEL_4.15
ASEL_63
  Bottom 0.152: AMUX_4.16 33.88,76 33.88,76.68 38.48,81.28 ASEL_4.16
C_0  (via drill 0.35)
  Top 0.152: 26.98,48.31 26.36,47.7 26.06,47.7 SW.9 | 26.98,48.31 27.13,48.46 27.13,49.38 26.98,49.53 17.83,49.53 14.94,52.43 4.12,52.43 3.96,52.27 3.96,50.9 4.72,50.14 4.72,48.31 LED1.2 | v35.97,49.84 36.12,49.99 39.01,49.99 CMUX.10 | v30.48,49.68 28.35,47.55 27.74,47.55 26.98,48.31
  Bottom 0.152: v35.97,49.84 35.81,49.68 v30.48,49.68
C_1
  Top 0.152: LED2.2 4.88,51.51 15.39,51.51 17.98,48.92 18.75,48.92 SW.7 18.9,48.77 19.36,48.77 19.96,48.16 19.96,35.66 24.08,31.55 27.89,31.55 35.36,39.01 35.36,50.14 35.81,50.6 39.01,50.6 CMUX.11
C_2
  Top 0.152: LED3.2 13.72,54.86 18.29,50.29 18.75,50.29 SW.6 18.9,50.29 19.36,50.75 32,50.75 CMUX.14
C_3  (via drill 0.35)
  Top 0.152: LED4.2 4.88,58.06 11.28,58.06 17.83,51.51 18.75,51.51 SW.5 18.9,51.36 v23.77,51.36 | v27.43,51.36 32,51.36 CMUX.13
  Bottom 0.152: v23.77,51.36 v27.43,51.36
CLK  (via drill 0.35)
  Top 0.152: v7.92,33.53 7.92,36.58 11.58,40.23 ADC.10 | SV1.2 20.42,5.03 23.93,1.52 29.57,1.52 32.92,4.88 32.92,14.48 INPUT.1 33.07,14.63 34.29,15.85 34.29,20.27 33.53,21.03 32.77,21.03 31.85,21.95 30.63,21.95 29.11,23.47 14.02,23.47 OUTPUT.1
  Bottom 0.152: v7.92,33.53 7.92,30.33 13.87,24.38 13.87,23.62 OUTPUT.1
CLR  (via drill 0.35)
  Top 0.152: v28.04,48.16 28.04,48.92 26.82,50.14 26.06,50.14 SW.11
  Bottom 0.152: v28.04,48.16 28.04,45.26 25.3,42.52 25.3,26.36 25.6,26.06 | 25.6,26.06 30.48,21.18 INPUT.6 30.48,20.73 29.11,19.36 29.11,12.8 R2.S | 25.6,26.06 17.07,17.53 16.92,17.53 16.61,17.22 OUTPUT.6
CNT  (via drill 0.35)
  Top 0.152: SV2.2 29.72,6.86 29.72,12.65 32.92,15.85 32.92,17.07 INPUT.3 33.07,17.22 33.07,18.29 33.98,19.2 33.98,20.12 33.38,20.73 31.7,20.73 30.94,19.96 17.68,19.96 16.76,20.88 14.02,20.88 OUTPUT.3 | v24.38,32.16 24.38,47.7 25.45,48.77 25.91,48.77 SW.10
  Bottom 0.152: v24.38,32.16 14.78,22.55 14.78,21.95 13.87,21.03 OUTPUT.3
CSEL_0
  Top 0.152: CMUX.9 39.17,49.44 39.85,49.44 45.72,43.56 45.72,40.64 CSEL.2
CSEL_1
  Top 0.152: CMUX.8 39.17,48.78 39.85,48.78 44.45,44.19 CSEL.1
CSEL_2
  Top 0.152: CMUX.7 39.17,48.13 39.85,48.13 43.05,44.93 43.05,40.51 CSEL.4
CSEL_3
  Top 0.152: CMUX.6 39.17,47.48 39.85,47.48 41.91,45.42 CSEL.3
CSEL_4
  Top 0.152: CMUX.5 39.17,46.84 39.85,46.84 40.69,45.99 40.69,40.44 39.62,39.37 CSEL.6
CSEL_5
  Top 0.152: CMUX.4 39.17,46.19 39.85,46.19 40.39,45.65 40.39,42.93 CSEL.5
CSEL_6
  Top 0.152: CMUX.3 39.05,45.53 38.37,45.53 35.69,42.85 35.69,40.51 CSEL.8
CSEL_7
  Top 0.152: CMUX.2 39.05,44.88 38.37,44.88 36.83,43.34 CSEL.7
CSEL_8
  Top 0.152: CMUX.23 32.07,44.88 33.01,44.88 34.04,43.85 34.04,43.18 33.27,42.42 33.27,40.39 CSEL.10
CSEL_9
  Top 0.152: CMUX.22 32.07,45.53 33.26,45.53 34.54,44.25 34.54,42.16 CSEL.9
CSEL_10
  Top 0.152: CMUX.21 32,46.13 31.94,46.19 31.27,46.19 30.73,45.65 30.73,43.69 31.24,43.18 32.26,43.18 32.84,42.6 32.84,40.46 CSEL.12
CSEL_11
  Top 0.152: CSEL.11 30.35,43.31 30.35,45.92 31.27,46.84 31.95,46.84 CMUX.20
CSEL_12
  Top 0.152: CMUX.19 31.94,47.5 31.24,47.5 29.84,46.1 29.84,42.93 30.35,42.42 30.35,40.64 29.21,39.5 CSEL.14
CSEL_13
  Top 0.152: CSEL.13 29.21,46.1 31.19,48.08 CMUX.18
CSEL_14
  Top 0.152: CMUX.17 31.95,48.78 31.08,48.78 27.94,45.64 27.94,40.64 CSEL.16
CSEL_15
  Top 0.152: CMUX.16 31.95,49.44 31.27,49.44 26.67,44.84 CSEL.15
DATA  (via drill 0.35)
  Top 0.152: v7.01,33.53 7.01,36.88 11.43,41.3 11.89,41.3 12.19,41 12.19,40.39 ADC.9 | INPUT.5 32.92,19.66 17.83,19.66 16.61,18.44 14.02,18.44 OUTPUT.5
  Bottom 0.152: v7.01,33.53 7.01,29.72 12.65,24.08 12.65,19.96 13.87,18.75 13.87,18.44 OUTPUT.5
GND  (via drill 0.35, 1)
  Top 0.305: C2.1 12.7,34.63 ADC.3
  other vias: 35.69,73.91 38.1,72.26 33.91,82.55 26.8,85.98 7.11,85.47 12.32,83.44 11.43,73.91 12.45,71.5 9.65,81.28 4.7,39.62 13.34,45.97 17.53,31.5 34.16,58.17 35.31,52.96 12.45,60.96 10.54,33.53 8.64,53.59 36.7,46.86 20.45,87.5 23.24,86.87 16.89,86.87 22.23,60.07 24.77,70.1 32,67.18 25.78,60.33 22.23,40.64 28.7,35.69 33.02,60.33 40.89,58.93 39.37,54.36 29.21,54.1 21.84,12.95 30.99,8.89 26.29,83.06 17.65,34.67
  pour Top: -1.27,90.17 48.26,90.17 48.26,-1.27 -1.27,-1.27
  pour Bottom: -1.27,90.17 48.26,90.17 48.26,-1.27 -1.27,-1.27
N$35
  Top 0.152: R1.A 11.43,5.03 15.24,5.03 17.68,2.59 20.27,2.59 SV1.1
N$41
  Top 0.152: R2.A 31.7,5.03 30.48,5.03 28.04,2.59 SV2.1
SS
  Top 0.152: ADC.6 13.72,40.23 14.94,40.23 24.05,31.11 R5.A 32.89,29.97 42.67,29.97 SS.1
V_DIV  (via drill 0.35, 1)
  Top 0.152: ADC.2 12.19,35.97 11.73,35.97 ADC.1 11.58,35.97 11.58,36.58 10.82,37.34 v10.82,37.95 | v30.33,51.97 35.66,57.3 36.88,57.3 AMUX_0.8
  Bottom 0.152: v30.33,51.97 21.49,43.13 18.67,43.13 18.62,43.13 | 10.82,43.13 4.72,43.13 3.5,41.91 R4.A | 10.82,43.13 18.62,43.13 | 10.82,43.13 v10.82,37.95 | v17.53,42.04 18.62,43.13

### Text on the board
tNames: 0 | 1 | 2 | 3 | 4 | 5 | COLUMN / INDEX | COLUMNS 0-15 | COLUMNS 16-31 | COLUMNS 32-47 | COLUMNS 48-63 | BYU / RADLab | Tactile Sensor Grid V2.1 | 3 | ROW INDEX | 2 | 1 | 0 | POWER | VOLTAGE / DIVIDER | V_DIV | ROWS 0-15 | ADC 1 | CHIP SELECT / TERMINATION | GND | ADC 2 | SS | COM OUT | COM IN | SPI CLOCK / TERMINATION | COUNTER / TERMINATION | OFF | ON